# EAGLE board SensorNodeBoard_4_2_1AZ1b (EAGLE 7.6.0), part 1 of 2
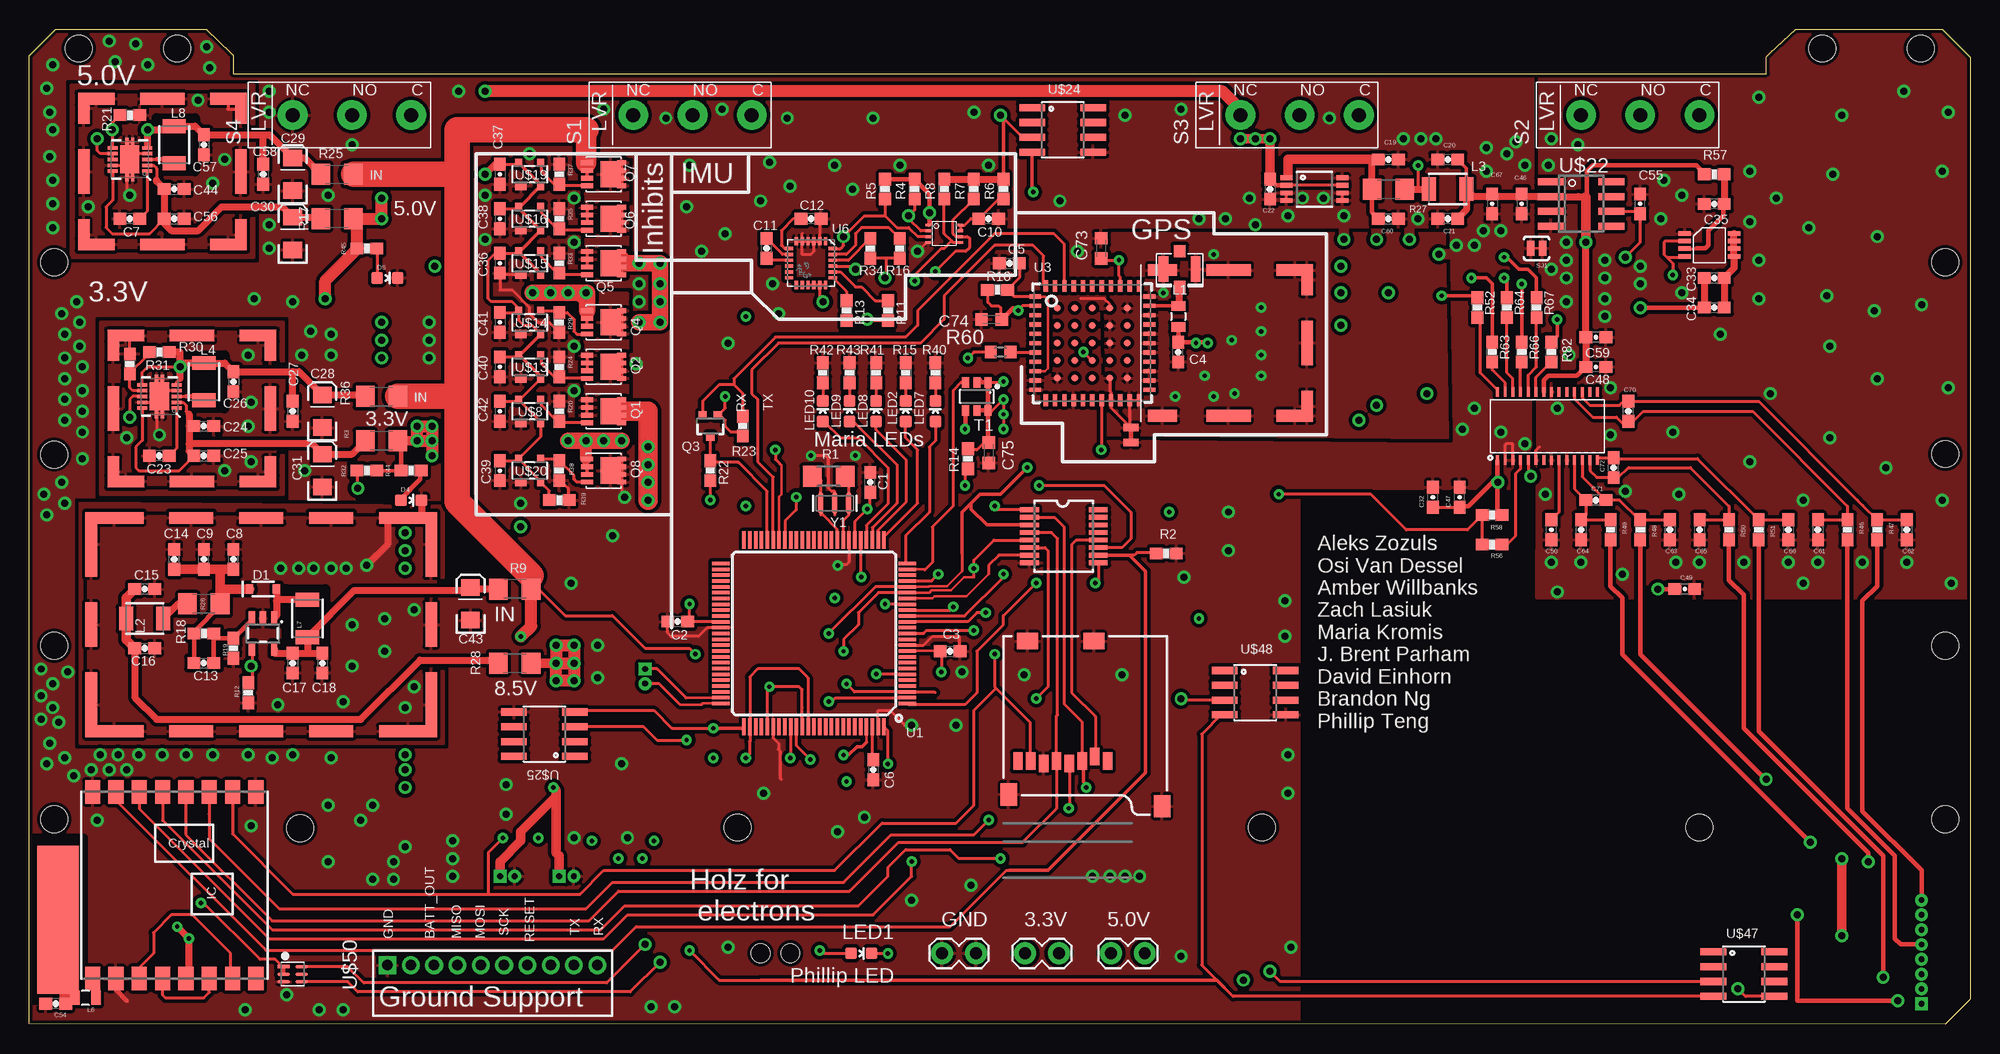
[diagram p7: board, top side]
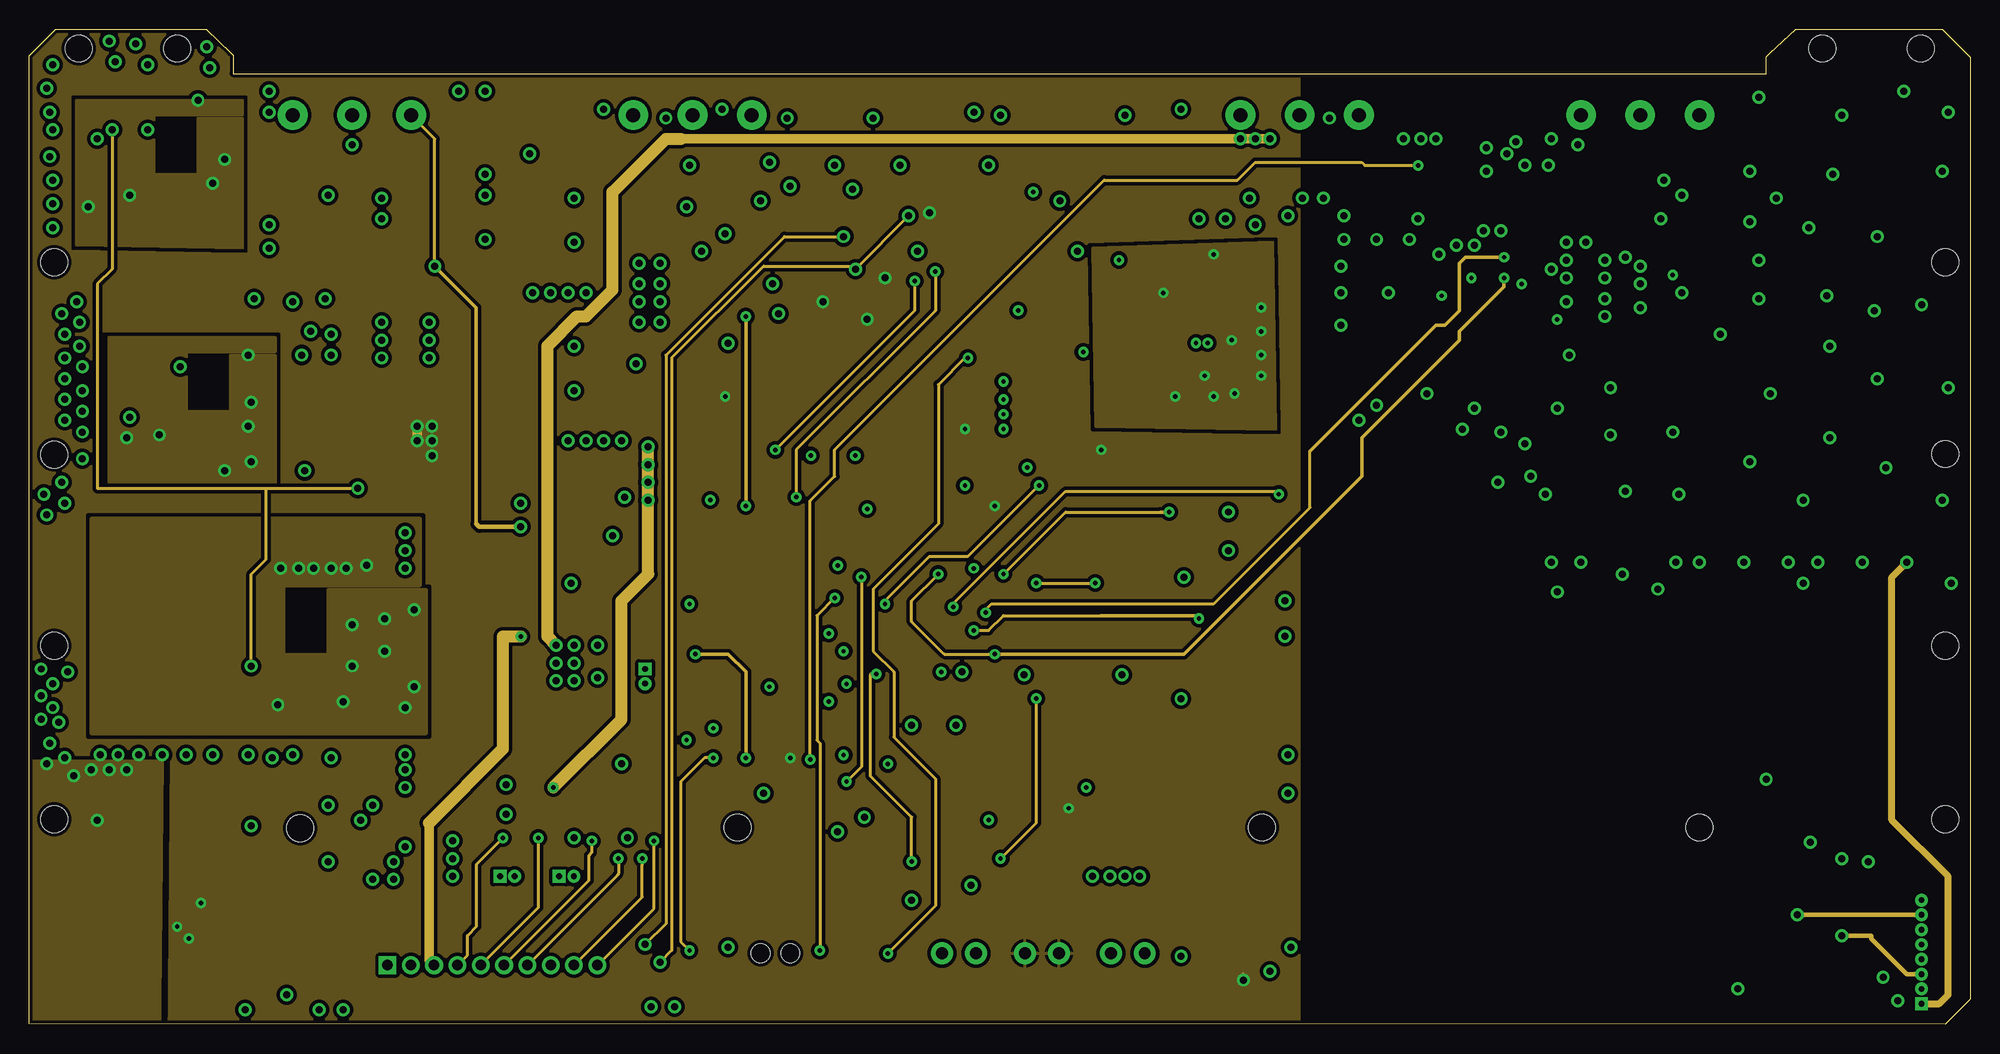
[diagram p8: board, inner layer Route2]
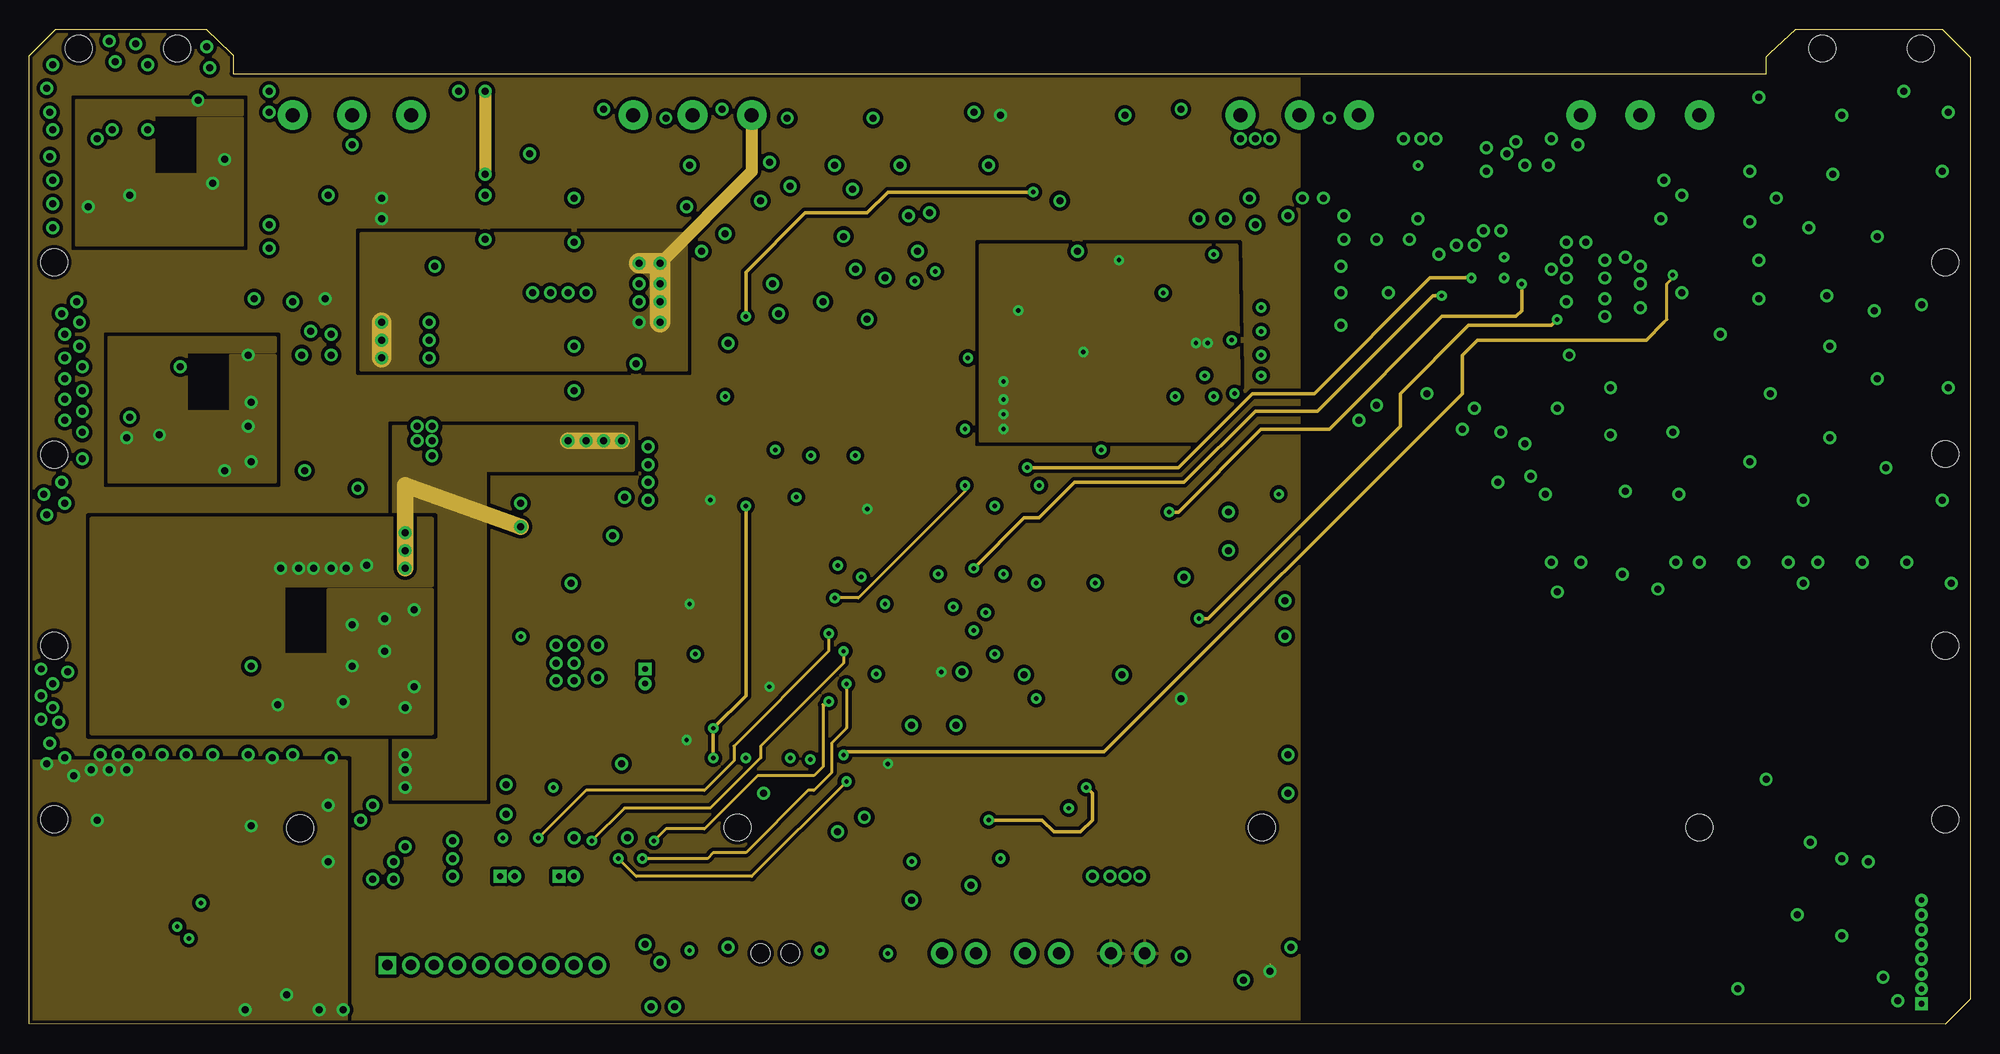
[diagram p9: board, inner layer Route15]
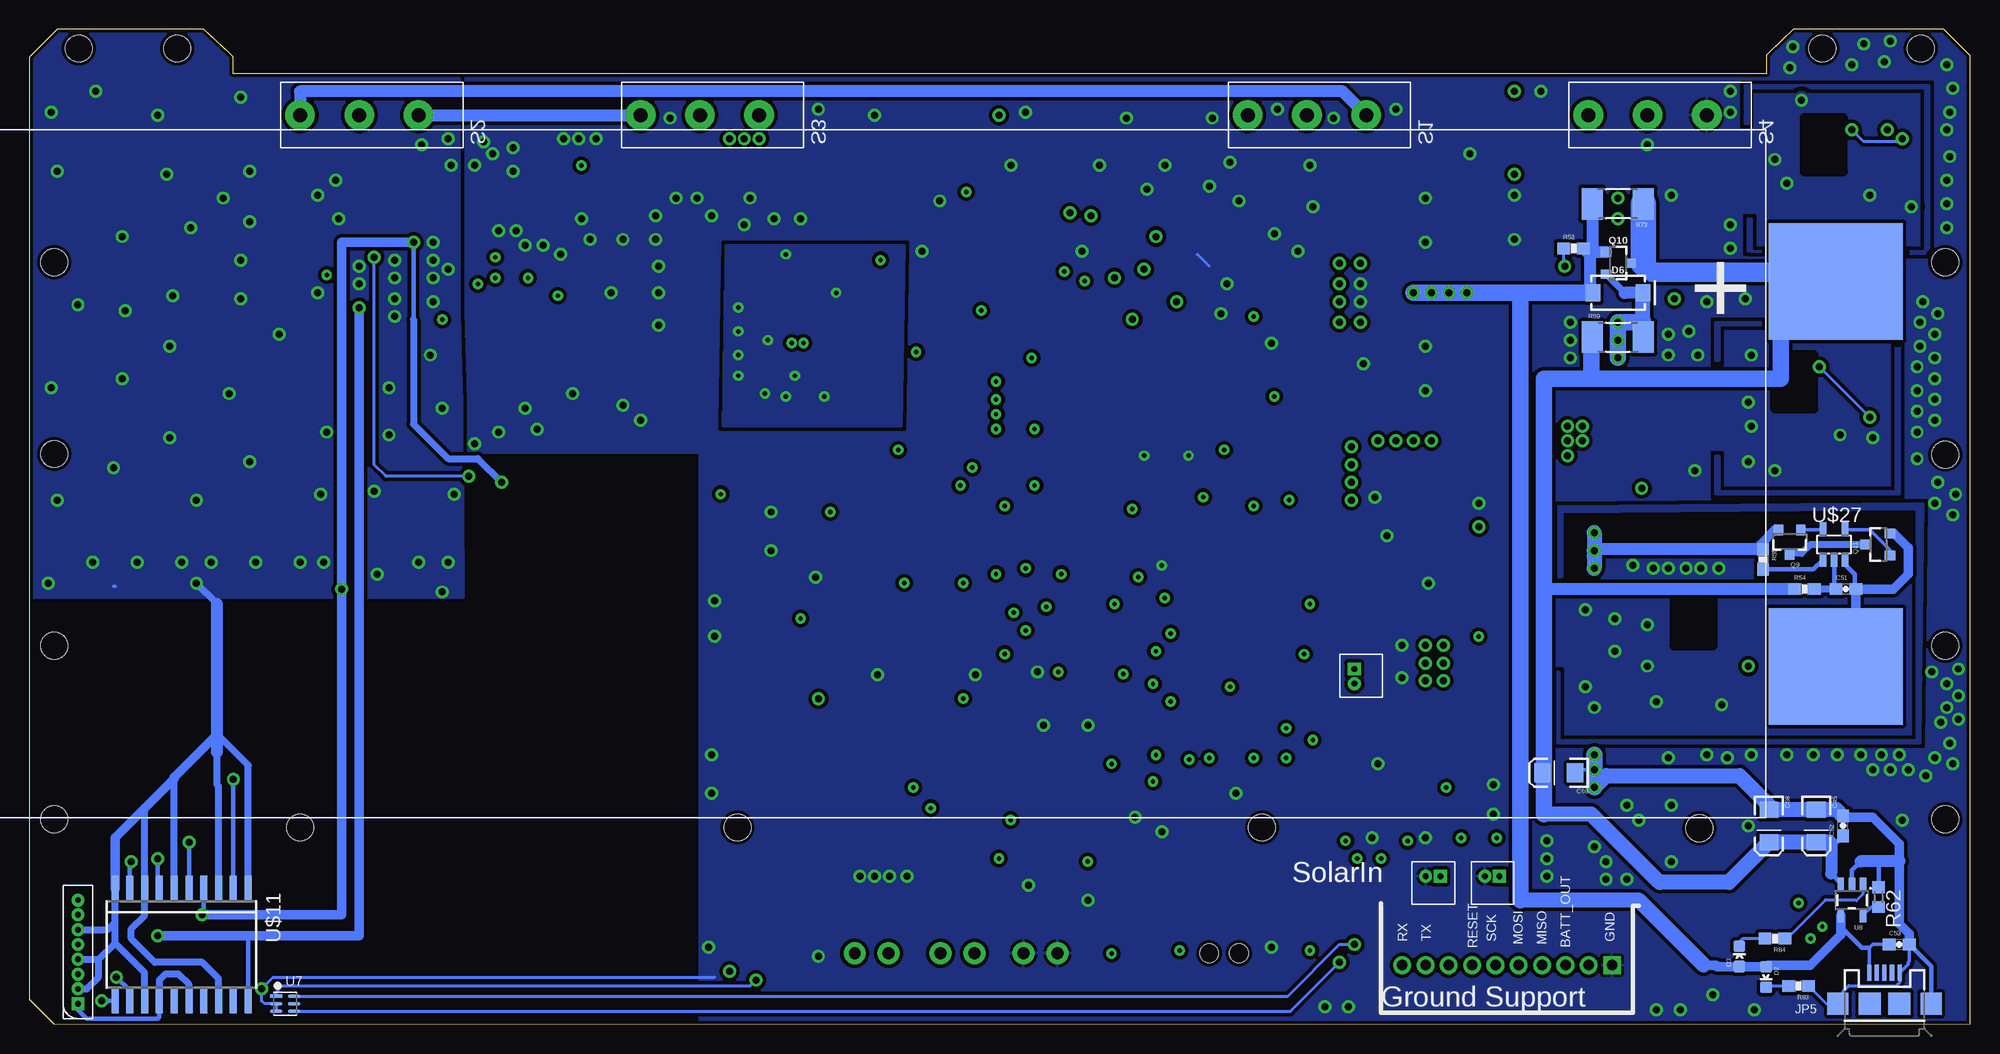
[diagram p10: board, bottom side, seen from below]

Size 166.49 x 85.34 mm. Coordinates in mm from the lower left corner, seen from the top.
Outline: 2.29,85.34 15.21,85.34 17.27,83.31 17.49,83.09 17.49,81.53 149,81.53 149,82.96 149.35,83.31 151.54,85.34 164.08,85.34 166.49,82.94 166.49,2.15 164.34,0 0,0.04 0,83.06 2.29,85.34
Copper layers (1*2*15*16): Top 0.035mm / dielectric 1.5mm / Route2 0.035mm / dielectric 0.15mm / Route15 0.035mm / dielectric 0.2mm / Bottom 0.035mm
Design rules "SparkFun *": minimum track width 8mil, minimum drill 20mil, track to track 7mil, track to pad 8mil, pad to pad 6mil, via to via 8mil, smd to smd 6mil, copper to edge 10mil, drill to drill 8mil, minimum pad ring 12mil, minimum via ring 10mil, stop-mask expansion 4mil, vias tented up to drill 25mil, thermal gap 10mil
Holes 2.29 mm at 2.15,65.36 2.15,48.86 2.15,17.6 2.15,32.48 164.35,65.35 164.35,48.92 164.35,32.48 164.35,17.6 162.25,83.69 153.79,83.69 12.7,83.69 4.25,83.69 60.75,16.89 23.25,16.83 143.25,16.89 105.75,16.89
Holes 1.6 mm at 62.74,6.1 65.28,6.1
tRestrict: area 22.1,32 to 25.4,37.3; area 10.9,73.2 to 14.2,77.7; area 13.5,52.8 to 16.8,57.4; area 1.8,1.8 to 5.3,2.8
bRestrict: area 22.1,32.5 to 25.4,37.3; area 10.9,73.2 to 14.2,77.7; area 13.5,52.8 to 16.8,57.4

## Footprints (pad centres in the part's own frame; a part is rotated, then mirrored left to right if it is on the bottom)
0603-CAP = smd 1.1 x 1: 1 -0.85,0; 2 0.85,0
EIA3216 = smd 1.4 x 1.6: A 1.4,0; C -1.4,0
C0603K = smd 1.05 x 1.08: 1 -0.875,0; 2 0.875,0
SOD-323 = smd 0.63 x 0.83: A 1.15,0; C -1.15,0
LED-0603 = smd 1 x 1: A 0,-0.877; C 0,0.877
SMA-DIODE = smd 1.27 x 1.47: A -2.15,0; C 2.15,0
1X02_1.25 = drill 0.5 square: P$1 0,0 | drill 0.5: P$2 1.25,0
U.FL = smd 2.2 x 0.85: P$1 0,1.375; P$2 0,-1.375 | smd 1.05 x 1: P$3 1.525,0; P$4 -1.525,0
USB-MICROB = smd 0.35 x 1.4: D+ 0,2.65; D- -0.65,2.65; GND 1.3,2.65; ID 0.65,2.65; VBUS -1.3,2.65 | smd 1.8 x 1.9: MT1 -4,0; MT2 4,0 | smd 1.9 x 1.9: P$1 -1.27,0; P$2 1.27,0
1X02_LOCK = drill 1.016 pad 1.88: 1 -0.178,0; 2 2.718,0
0805 = smd 0.8 x 1.2: 1 -0.9,0; 2 0.9,0
1210 = smd 1.2 x 2: 1 -1.6,0; 2 1.6,0
2PT_GND_TIE = smd 1.27 x 0.635: P$1 0,0.635; P$2 0,-0.635
POWERPAK1212-8 = smd 0.762 x 0.406: D1 1.549,0.991; D2 1.549,0.33; D3 1.549,-0.33; D4 1.549,-0.991 | smd 1.727 x 2.235: DPAD 0.584,0 | smd 0.991 x 0.406: G -1.422,-0.991; S1 -1.422,0.991; S2 -1.422,0.33; S3 -1.422,-0.33
SOT323 = smd 0.7 x 0.7: 1 -0.65,-0.925; 2 0.65,-0.925; 3 0,0.925
SOT23-3@1 = smd 0.8 x 0.9: 1 -0.95,-1; 2 0.95,-1; 3 0,1.1
SOT23-3 = smd 0.8 x 0.9: 1 -0.95,-1; 2 0.95,-1; 3 0,1.1
R1206 = smd 1.6 x 1.803: 1 -1.422,0; 2 1.422,0
0603-RES = smd 1.1 x 1: 1 -0.85,0; 2 0.85,0
1206 = smd 1.6 x 1.8: 1 -1.4,0; 2 1.4,0
R2010 = smd 1.8 x 2.7: 1 -2.2,0; 2 2.2,0
R0603 = smd 1 x 1.1: 1 -0.85,0; 2 0.85,0
CHERRY_SWITCH = drill 1.2 pad 2.54: COM 10.16,0; NC 0,0; NO 5.08,0
PAD-JUMPER-2-NC_BY_TRACE_YES_SILK = smd 0.635 x 1.27: 1 -0.508,0; 2 0.508,0
SOT23-6 = smd 0.6 x 0.9: 1 -0.95,-1.2; 2 0,-1.2; 3 0.95,-1.2; 4 0.95,1.2; 5 0,1.2; 6 -0.95,1.2
TQFP100 = smd 1.5 x 0.3: 1 -8,6; 2 -8,5.5; 3 -8,5; 4 -8,4.5; 5 -8,4; 6 -8,3.5; 7 -8,3; 8 -8,2.5; 9 -8,2; 10 -8,1.5; 11 -8,1; 12 -8,0.5; 13 -8,0; 14 -8,-0.5; 15 -8,-1; 16 -8,-1.5; 17 -8,-2; 18 -8,-2.5; 19 -8,-3; 20 -8,-3.5; 21 -8,-4; 22 -8,-4.5; 23 -8,-5; 24 -8,-5.5; 25 -8,-6; 51 8,-6; 52 8,-5.5; 53 8,-5; 54 8,-4.5; 55 8,-4; 56 8,-3.5; 57 8,-3; 58 8,-2.5; 59 8,-2; 60 8,-1.5; 61 8,-1; 62 8,-0.5; 63 8,0; 64 8,0.5; 65 8,1; 66 8,1.5; 67 8,2; 68 8,2.5; 69 8,3; 70 8,3.5; 71 8,4; 72 8,4.5; 73 8,5; 74 8,5.5; 75 8,6 | smd 0.3 x 1.5: 26 -6,-8; 27 -5.5,-8; 28 -5,-8; 29 -4.5,-8; 30 -4,-8; 31 -3.5,-8; 32 -3,-8; 33 -2.5,-8; 34 -2,-8; 35 -1.5,-8; 36 -1,-8; 37 -0.5,-8; 38 0,-8; 39 0.5,-8; 40 1,-8; 41 1.5,-8; 42 2,-8; 43 2.5,-8; 44 3,-8; 45 3.5,-8; 46 4,-8; 47 4.5,-8; 48 5,-8; 49 5.5,-8; 50 6,-8; 76 6,8; 77 5.5,8; 78 5,8; 79 4.5,8; 80 4,8; 81 3.5,8; 82 3,8; 83 2.5,8; 84 2,8; 85 1.5,8; 86 1,8; 87 0.5,8; 88 0,8; 89 -0.5,8; 90 -1,8; 91 -1.5,8; 92 -2,8; 93 -2.5,8; 94 -3,8; 95 -3.5,8; 96 -4,8; 97 -4.5,8; 98 -5,8; 99 -5.5,8; 100 -6,8
MICRO-SD-SOCKET-PP = smd 1.8 x 1.4: CD1 -2.05,0.4; CD2 -7.75,0.4 | smd 0.8 x 1.5: CS -7.84,10.3; DI -6.74,10.7; DO -2.34,10.7; GND -3.44,10.9; RSV1 -8.94,10.7; RSV2 -1.24,10.7; SCLK -4.54,10.7; VCC -5.64,10.9 | smd 1.4 x 1.9: GND1 -13.6,14.55; GND3 -0.45,13.55
VENUS638FLPX = smd 1 x 0.36: 1 -4.9,4; 2 -4.9,3.2; 3 -4.9,2.4; 4 -4.9,1.6; 5 -4.9,0.8; 6 -4.9,0; 7 -4.9,-0.8; 8 -4.9,-1.6; 9 -4.9,-2.4; 10 -4.9,-3.2; 11 -4.9,-4; 23 4.9,-4; 24 4.9,-3.2; 25 4.9,-2.4; 26 4.9,-1.6; 27 4.9,-0.8; 28 4.9,0; 29 4.9,0.8; 30 4.9,1.6; 31 4.9,2.4; 32 4.9,3.2; 33 4.9,4 | smd 0.36 x 1: 12 -4,-4.9; 13 -3.2,-4.9; 14 -2.4,-4.9; 15 -1.6,-4.9; 16 -0.8,-4.9; 17 0,-4.9; 18 0.8,-4.9; 19 1.6,-4.9; 20 2.4,-4.9; 21 3.2,-4.9; 22 4,-4.9; 34 4,4.9; 35 3.2,4.9; 36 2.4,4.9; 37 1.6,4.9; 38 0.8,4.9; 39 0,4.9; 40 -0.8,4.9; 41 -1.6,4.9; 42 -2.4,4.9; 43 -3.2,4.9; 44 -4,4.9 | smd 0.6 x 0.6: 45 -3,3; 46 -3,1.5; 47 -3,0; 48 -3,-1.5; 49 -3,-3; 50 -1.5,3; 51 -1.5,1.5; 52 -1.5,0; 53 -1.5,-1.5; 54 -1.5,-3; 55 0,3; 56 0,1.5; 57 0,0; 58 0,-1.5; 59 0,-3; 60 1.5,3; 61 1.5,1.5; 62 1.5,0; 63 1.5,-1.5; 64 1.5,-3; 65 3,3; 66 3,1.5; 67 3,0; 68 3,-1.5; 69 3,-3
PSOP-8 = smd 0.25 x 0.5: 1 -0.73,-1.37; 2 -0.23,-1.37; 3 0.27,-1.37; 4 0.77,-1.37; 5 0.77,1.38; 6 0.27,1.38; 7 -0.23,1.38; 8 -0.73,1.38
QFN-10_PAD = smd 0.297 x 0.85: 1 -1,-1.475; 2 -0.5,-1.475; 3 0,-1.475; 4 0.5,-1.475; 5 1,-1.475; 6 1,1.475; 7 0.5,1.475; 8 0,1.475; 9 -0.5,1.475; 10 -1,1.475 | smd 0.7 x 0.28: 11 -1.5,0.25; 12 -1.5,-0.25; 13 1.5,0.25; 14 1.5,-0.25 | smd 2.4 x 1.65: 15 0,0
LGA-24 = smd 0.7 x 0.29: 1 -1.875,1.25; 2 -1.875,0.75; 3 -1.875,0.25; 4 -1.875,-0.25; 5 -1.875,-0.75; 6 -1.875,-1.25; 13 1.875,-1.25; 14 1.875,-0.75; 15 1.875,-0.25; 16 1.875,0.25; 17 1.875,0.75; 18 1.875,1.25 | smd 0.29 x 0.7: 7 -1.25,-1.875; 8 -0.75,-1.875; 9 -0.25,-1.875; 10 0.25,-1.875; 11 0.75,-1.875; 12 1.25,-1.875; 19 1.25,1.875; 20 0.75,1.875; 21 0.25,1.875; 22 -0.25,1.875; 23 -0.75,1.875; 24 -1.25,1.875
FN-6 = smd 1.05 x 0.3: 1 -0.775,0.65; 2 -0.775,0; 3 -0.775,-0.65; 4 0.775,-0.65; 5 0.775,0; 6 0.775,0.65
SOT23-5 = smd 0.55 x 1.2: 1 -0.95,-1.3; 2 0,-1.3; 3 0.95,-1.3; 4 0.95,1.3; 5 -0.95,1.3
TSSOP16 = smd 0.4 x 1.6: 1 -2.225,-2.85; 2 -1.575,-2.85; 3 -0.925,-2.85; 4 -0.275,-2.85; 5 0.375,-2.85; 6 1.025,-2.85; 7 1.675,-2.85; 8 2.325,-2.85; 9 2.325,3.05; 10 1.675,3.05; 11 1.025,3.05; 12 0.375,3.05; 13 -0.275,3.05; 14 -0.925,3.05; 15 -1.575,3.05; 16 -2.225,3.05
RFM22-XXX-S2 = smd 2 x 1.3: 1 -8,7; 2 -8,5; 3 -8,3; 4 -8,1; 5 -8,-1; 6 -8,-3; 7 -8,-5; 8 -8,-7; 9 8,-7; 10 8,-5; 11 8,-3; 12 8,-1; 13 8,1; 14 8,3; 15 8,5; 16 8,7
MSOP-8 = smd 0.41 x 1.02: 1 -0.975,-2.4; 2 -0.325,-2.4; 3 0.325,-2.4; 4 0.975,-2.4; 5 0.975,2.4; 6 0.325,2.4; 7 -0.325,2.4; 8 -0.975,2.4
TSSOP28 = smd 0.8 x 0.25: 1 -2.921,4.623; 2 -2.921,3.962; 3 -2.921,3.302; 4 -2.921,2.642; 5 -2.921,1.981; 6 -2.921,1.321; 7 -2.921,0.66; 8 -2.927,0; 9 -2.921,-0.66; 10 -2.921,-1.321; 11 -2.921,-1.981; 12 -2.921,-2.642; 13 -2.921,-3.302; 14 -2.921,-3.962; 15 2.921,-3.962; 16 2.921,-3.302; 17 2.921,-2.642; 18 2.921,-1.981; 19 2.921,-1.321; 20 2.921,-0.66; 21 2.927,0; 22 2.921,0.66; 23 2.921,1.321; 24 2.921,1.981; 25 2.921,2.642; 26 2.921,3.302; 27 2.921,3.962; 28 2.921,4.623
SOT143 = smd 1 x 0.7: 1 -0.75,-1 | smd 0.6 x 0.7: 2 0.95,-1; 3 0.95,1; 4 -0.95,1
SOIC20R = smd 0.6 x 2.2: 1 -5.715,-4.775; 2 -4.445,-4.775; 3 -3.175,-4.775; 4 -1.905,-4.775; 5 -0.635,-4.775; 6 0.635,-4.775; 7 1.905,-4.775; 8 3.175,-4.775; 9 4.445,-4.8; 10 5.715,-4.8; 11 5.715,4.8; 12 4.445,4.8; 13 3.175,4.8; 14 1.905,4.8; 15 0.635,4.8; 16 -0.635,4.8; 17 -1.905,4.8; 18 -3.175,4.8; 19 -4.445,4.8; 20 -5.715,4.8
HMC1001 = drill 0.5 square: P$1 0,0 | drill 0.5: P$2 1.27,0; P$3 2.54,0; P$4 3.81,0; P$5 5.08,0; P$6 6.35,0; P$7 7.62,0; P$8 8.89,0
MICRO8 = smd 1.04 x 0.38: P$1 0,0; P$2 0,-0.65; P$3 0,-1.3; P$4 0,-1.95; P$5 4.24,0; P$6 4.24,-0.65; P$7 4.24,-1.3; P$8 4.24,-1.95
BATTERY = smd 11.492 x 10: + -6,13; - -6,46
SOIC8 = smd 0.6 x 2.2: 1 -1.905,-2.6; 2 -0.635,-2.6; 3 0.635,-2.6; 4 1.905,-2.6; 5 1.905,2.6; 6 0.635,2.6; 7 -0.635,2.6; 8 -1.905,2.6
SLOT = smd 12.7 x 3.556: P$1 6.5,2.746
SO08 = smd 0.61 x 2.21: 1 -1.905,-2.616; 2 -0.635,-2.616; 3 0.635,-2.616; 4 1.905,-2.616; 5 1.905,2.616; 6 0.635,2.616; 7 -0.635,2.616; 8 -1.905,2.616
SOT25 = smd 0.55 x 1.2: 1 -0.95,-1.3; 2 0,-1.3; 3 0.95,-1.3; 4 0.95,1.3; 5 -0.95,1.3
SHIELD_BMI-S-209-C = smd 4.98 x 1: P$1 2.49,0.5; P$5 27.67,0.5; P$9 2.49,18.8; P$13 27.67,18.8 | smd 3.8 x 1: P$2 9.08,0.5; P$3 15.08,0.5; P$4 21.08,0.5; P$10 9.08,18.8; P$11 15.08,18.8; P$12 21.08,18.8 | smd 1 x 5.55: P$6 0.5,2.775; P$8 0.5,16.525; P$14 29.66,16.525; P$16 29.66,2.775 | smd 1 x 3.8: P$7 0.5,9.65; P$15 29.66,9.65
SHIELD_BMI-S-201-C = smd 2.65 x 1: P$1 1.325,0.5; P$3 12.175,0.5; P$10 1.325,13.96; P$12 12.175,13.96 | smd 3.8 x 1: P$2 6.75,0.5; P$11 6.75,13.96 | smd 1 x 3.13: P$4 0.5,1.565; P$5 13,1.565; P$8 0.5,12.895; P$9 13,12.895 | smd 1 x 3.8: P$6 0.5,7.23; P$7 13,7.23
SULLRT1X10-2MM = drill 0.9 square: 1 0,0 | drill 0.9: 2 2,0; 3 4,0; 4 6,0; 5 8,0; 6 10,0; 7 12,0; 8 14,0; 9 16,0; 10 18,0
SHIELD_BMI-201-C-REV = smd 2.65 x 1: P$1 1.325,0.5; P$3 12.175,0.5 | smd 3.8 x 1: P$2 6.75,0.5 | smd 1 x 3.13: P$4 0.5,1.565; P$5 13,1.565 | smd 1 x 3.8: P$6 0.5,7.23; P$7 13,7.23 | smd 1 x 2.5: P$8 0.5,12.895; P$9 13,12.895
RESONATOR-SMD = smd 0.45 x 1.905: 1 -1.2,0; 2 0,0; 3 1.2,0

## Placement (x,y rotation side)
C1  .1uf  [0603-CAP]  72.14,46.48 90 top
C2  .1uf  [0603-CAP]  55.63,34.54 180 top
C3  10uf  [0603-CAP]  78.99,32 0 top
C4  22pF  [0603-CAP]  98.55,57.66 90 top
C5  1uF  [0603-CAP]  84.07,65.28 0 top
C6  .1uf  [0603-CAP]  72.39,21.84 270 top
C7  0.1uF  [0603-CAP]  8.64,69.09 180 top
C8  10uF  [0603-CAP]  17.53,39.88 90 top
C9  1uF  [0603-CAP]  14.99,39.88 90 top
C10  0.1uF  [0603-CAP]  82.3,69.09 180 top
C11  0.22uF  [0603-CAP]  63.25,66.55 90 top
C12  4.7uF  [0603-CAP]  67.06,69.09 180 top
C13  330pF  [0603-CAP]  14.99,30.99 0 top
C14  0.1uF  [0603-CAP]  12.45,39.88 90 top
C15  10uF  [0603-CAP]  9.91,37.34 0 top
C16  10uF  [0603-CAP]  9.91,32.26 0 top
C17  0.1uF  [0603-CAP]  22.61,30.99 270 top
C18  10uF  [0603-CAP]  25.15,30.99 270 top
C19  0.1uF  [0603-CAP]  116.59,74.17 0 top
C20  10uF  [0603-CAP]  121.67,74.17 180 top
C21  10uF  [0603-CAP]  121.67,69.09 180 top
C22  1uF  [0603-CAP]  106.43,71.63 270 top
C23  0.1uF  [0603-CAP]  11.18,48.77 180 top
C24  0.1uF  [0603-CAP]  14.99,51.31 0 top
C25  10uF  [0603-CAP]  14.99,48.77 0 top
C26  10uF  [0603-CAP]  17.53,55.12 270 top
C27  0.1uF  [0603-CAP]  22.61,52.58 270 top
C28  [EIA3216]  25.15,52.58 90 top
C29  [EIA3216]  22.61,72.9 90 top
C30  [EIA3216]  22.61,67.82 90 top
C31  [EIA3216]  25.15,47.5 90 top
C32  10uF  [0603-CAP]  120.4,45.21 90 top
C33  0.1uF  [0603-CAP]  144.53,64.01 0 top
C34  0.1uF  [0603-CAP]  144.53,61.47 0 top
C35  1uF  [0603-CAP]  144.53,70.36 180 top
C36  4.7u  [0603-CAP]  40.39,65.28 270 top
C37  4.7u  [0603-CAP]  40.39,72.9 270 top
C38  4.7u  [0603-CAP]  40.39,69.09 270 top
C39  4.7u  [0603-CAP]  40.39,47.5 270 top
C40  4.7u  [0603-CAP]  40.39,56.39 270 top
C41  4.7u  [0603-CAP]  40.39,60.2 270 top
C42  [0603-CAP]  40.39,52.58 270 top
C43  47uF  [EIA3216]  37.85,36.07 90 top
C44  0.1uF  [0603-CAP]  12.45,71.63 0 top
C45  47uF  [EIA3216]  13.21,17.02 270 bottom
C46  0.1uF  [0603-CAP]  128.02,70.36 270 top
C47  0.1uF  [0603-CAP]  122.68,45.21 90 top
C48  0.1uF  [0603-CAP]  134.37,56.39 180 top
C49  0.1u  [0603-CAP]  141.99,37.34 0 top
C50  10uF  [0603-CAP]  130.56,42.42 90 top
C51  100nF  [0603-CAP]  10.67,37.34 0 bottom
C52  4.7uF  [0603-CAP]  10.92,17.02 90 bottom
C53  4.7uF  [0603-CAP]  6.1,6.86 0 bottom
C54  [0603-CAP]  2.29,1.78 180 top
C55  0.1uF  [0603-CAP]  138.18,70.36 90 top
C56  10uF  [0603-CAP]  12.45,69.09 0 top
C57  10uF  [0603-CAP]  14.99,75.44 270 top
C58  0.1uF  [0603-CAP]  20.07,72.9 270 top
C59  10uF  [0603-CAP]  134.37,58.93 180 top
C60  10uF  [0603-CAP]  116.59,69.09 0 top
C61  1uF  [0603-CAP]  153.42,42.42 270 top
C62  1uF  [0603-CAP]  161.04,42.42 270 top
C63  1uF  [0603-CAP]  140.72,42.42 270 top
C64  1uF  [0603-CAP]  133.1,42.42 270 top
C65  1uF  [0603-CAP]  143.26,42.42 270 top
C66  1uF  [0603-CAP]  150.88,42.42 270 top
C67  10uF  [0603-CAP]  125.48,70.36 270 top
C68  47uF  [EIA3216]  17.27,17.02 270 bottom
C69  47uF  [EIA3216]  35.31,21.59 180 bottom
C70  1uF  [0603-CAP]  137.16,52.58 90 top
C71  1uF  [0603-CAP]  134.37,44.96 180 top
C72  1uF  [0603-CAP]  135.89,47.75 90 top
C73  [C0603K]  91.95,66.55 90 top
C74  [C0603K]  82.55,60.45 180 top
C75  [C0603K]  82.3,49.02 270 top
D1  DIODE-BAS16J  [SOD-323]  20.07,37.34 0 top
D2  [LED-0603]  17.53,4.06 180 bottom
D3  [LED-0603]  19.81,5.84 0 bottom
D4  [LED-0603]  32.77,44.96 270 top
D5  [LED-0603]  30.73,64.01 270 top
D6  3A/40V/500mV  [SMA-DIODE]  30.23,62.74 0 bottom
J1  [1X02_1.25]  45.47,12.7 180 bottom
J2  U.FL  [U.FL]  98.68,64.77 270 top
J3  [1X02_1.25]  40.39,12.7 180 bottom
J4  [1X02_1.25]  52.83,30.48 270 bottom
JP5  USB-MICROB  [USB-MICROB]  7.37,1.78 0 bottom
JP12  [1X02_LOCK]  92.96,6.1 0 top
JP13  [1X02_LOCK]  85.6,6.1 0 top
JP14  [1X02_LOCK]  78.49,6.1 0 top
L1  33nH  [0805]  98.55,60.71 270 top
L2  10uH  [1210]  9.91,34.8 180 top
L3  10uH  [1210]  121.67,71.63 0 top
L4  2.2uH  [1210]  14.99,55.12 270 top
L6  [0805]  4.83,2.29 180 top
L7  10uH  [1210]  23.88,34.8 90 top
L8  2.2uH  [1210]  12.45,75.44 270 top
LED1  [LED-0603]  71.37,6.1 270 top
LED2  [LED-0603]  75.18,52.58 0 top
LED7  [LED-0603]  77.72,52.58 0 top
LED8  [LED-0603]  72.64,52.58 0 top
LED9  [LED-0603]  70.36,52.58 0 top
LED10  [LED-0603]  68.07,52.58 0 top
PT1  2PT_GND_TIE  [2PT_GND_TIE]  94.49,50.55 180 top
Q1  MOSFET-NCHANNELSI7820DN  [POWERPAK1212-8]  49.28,52.58 0 top
Q2  MOSFET-NCHANNELSI7820DN  [POWERPAK1212-8]  49.28,56.39 0 top
Q3  MOSFET-NCHANNEL2N7002PW  [SOT323]  58.42,51.31 180 top
Q4  MOSFET-NCHANNELSI7820DN  [POWERPAK1212-8]  49.28,60.2 0 top
Q5  MOSFET-NCHANNELSI7820DN  [POWERPAK1212-8]  49.28,65.28 0 top
Q6  MOSFET-NCHANNELSI7820DN  [POWERPAK1212-8]  49.28,69.09 0 top
Q7  MOSFET-NCHANNELSI7820DN  [POWERPAK1212-8]  49.28,72.9 0 top
Q8  MOSFET-NCHANNELSI7820DN  [POWERPAK1212-8]  49.28,47.5 0 top
Q9  MOSFET-NCHANNELSSM3K324R  [SOT23-3@1]  15.49,41.4 180 bottom
Q10  4.3A/20V/54mΩ  [SOT23-3]  30.23,65.28 270 bottom
Q11  MOSFET-NCHANNELSSM3K324R  [SOT23-3@1]  7.87,41.15 90 bottom
R1  1M  [R1206]  68.58,46.99 0 top
R2  10k  [0603-RES]  97.54,40.39 180 top
R3  0  [1206]  30.23,50.04 180 top
R4  1k  [0603-RES]  75.95,71.63 90 top
R5  1k  [0603-RES]  73.41,71.63 90 top
R6  200k  [0603-RES]  83.57,71.63 90 top
R7  1k  [0603-RES]  81.03,71.63 90 top
R8  1k  [0603-RES]  78.49,71.63 90 top
R9  [1206]  41.66,37.34 180 top
R10  33k  [0603-RES]  83.06,62.99 180 top
R11  10k  [0603-RES]  73.66,61.21 270 top
R12  10k  [0603-RES]  18.8,28.45 90 top
R13  10k  [0603-RES]  70.1,61.21 270 top
R14  750  [0603-RES]  80.52,48.51 90 top
R15  [0603-RES]  75.18,55.88 270 top
R16  10k  [0603-RES]  74.68,66.55 270 top
R17  0  [1206]  26.42,69.09 180 top
R18  75k  [0603-RES]  14.99,33.53 180 top
R19  13.3K  [0603-RES]  17.53,32.26 90 top
R20  5.1M  [0603-RES]  45.47,52.58 270 top
R21  10k  [0603-RES]  8.64,77.98 180 top
R22  10k  [0603-RES]  58.42,47.5 270 top
R23  10k  [0603-RES]  61.21,51.31 270 top
R24  5.1M  [0603-RES]  45.47,56.39 270 top
R25  0  [1206]  26.42,72.9 0 top
R26  [1206]  14.99,36.07 180 top
R27  [1206]  116.59,71.63 0 top
R28  [1206]  41.66,30.99 0 top
R29  5.1M  [0603-RES]  45.47,60.2 90 top
R30  1M  [0603-RES]  11.18,57.66 0 top
R31  100K  [0603-RES]  8.64,56.64 270 top
R32  0  [0603-RES]  28.96,47.5 0 top
R33  5.1M  [0603-RES]  45.47,65.28 270 top
R34  10k  [0603-RES]  72.14,66.55 270 top
R35  5.1M  [0603-RES]  45.47,69.09 270 top
R36  0  [1206]  30.23,53.85 0 top
R37  5.1M  [0603-RES]  45.47,72.9 270 top
R38  5.1M  [0603-RES]  45.47,47.5 90 top
R39  5.1M  [0603-RES]  45.47,44.96 180 top
R40  [0603-RES]  77.72,55.88 270 top
R41  750  [0603-RES]  72.64,55.88 90 top
R42  750  [0603-RES]  68.07,55.88 270 top
R43  750  [0603-RES]  70.36,55.88 270 top
R44  0  [0603-RES]  32.77,47.5 0 top
R45  0  [0603-RES]  28.96,66.55 0 top
R46  510  [0603-RES]  155.96,42.42 270 top
R47  510  [0603-RES]  158.5,42.42 270 top
R48  510  [0603-RES]  138.18,42.42 270 top
R49  510  [0603-RES]  135.64,42.42 270 top
R50  510  [0603-RES]  145.8,42.42 270 top
R51  510  [0603-RES]  148.34,42.42 270 top
R52  47  [0603-RES]  124.21,61.47 90 top
R53  100k  [0603-RES]  34.04,66.55 0 bottom
R54  470  [0603-RES]  14.22,37.34 0 bottom
R55  2.7k  [0603-RES]  17.78,39.88 270 bottom
R56  47  [0603-RES]  125.48,41.15 180 top
R57  220  [0603-RES]  144.53,72.9 0 top
R58  10k  [0603-RES]  125.48,43.69 180 top
R59  0  [R2010]  30.23,58.93 0 bottom
R60  [R0603]  83.31,57.66 0 top
R62  2k  [R0603]  7.87,10.92 270 bottom
R63  47  [0603-RES]  125.48,57.66 90 top
R64  47  [0603-RES]  126.75,61.47 90 top
R66  47  [0603-RES]  128.02,57.66 90 top
R67  47  [0603-RES]  129.29,61.47 90 top
R73  0  [R2010]  30.23,70.36 180 bottom
R82  47  [0603-RES]  130.56,57.66 90 top
R83  470  [0603-RES]  14.73,3.3 180 bottom
R84  470  [0603-RES]  16.76,7.37 180 bottom
S1  [CHERRY_SWITCH]  51.82,77.98 0 top
S2  [CHERRY_SWITCH]  133.1,77.98 0 top
S3  [CHERRY_SWITCH]  103.89,77.98 0 top
S4  [CHERRY_SWITCH]  22.61,77.98 0 top
SJ1  JUMPER-PAD-2-NC_BY_TRACE  [PAD-JUMPER-2-NC_BY_TRACE_YES_SILK]  129.29,66.55 180 top
T1  [SOT23-6]  81.28,53.85 180 top
U1  ATMEGA2560AU  [TQFP100]  67.31,33.53 180 top
U2  USD-SOCKETNEW  [MICRO-SD-SOCKET-PP]  83.57,33.27 180 top
U3  VENUS638FLPX-L  [VENUS638FLPX]  91.19,58.42 0 top
U4  [PSOP-8]  78.49,67.82 270 top
U5  TPS61200  [QFN-10_PAD]  11.18,53.85 90 top
U6  LSM9DS0  [LGA-24]  67.06,65.28 270 top
U7  TSL2561FN  [FN-6]  144.53,1.78 0 bottom
U8  MCP73831  [SOT23-5]  10.16,10.67 180 bottom
U9  TSL2561FN  [FN-6]  22.61,4.32 0 top
U11  TPS61200  [QFN-10_PAD]  8.64,74.17 90 top
U$1  74HC4050  [TSSOP16]  88.65,41.91 270 top
U$3  RFM22SMD  [RFM22-XXX-S2]  12.45,11.94 90 top
U$4  LM2731  [SOT23-5]  20.07,33.53 180 top
U$6  ADP3333  [MSOP-8]  110.24,71.63 270 top
U$7  ADS1248  [TSSOP28]  130.56,51.31 90 top
U$8  MIC5018  [SOT143]  42.93,52.58 0 top
U$11  HMC1002  [SOIC20R]  153.42,6.86 180 bottom
U$12  HMC1001  [HMC1001]  162.31,1.78 90 bottom
U$13  MIC5018  [SOT143]  42.93,56.39 0 top
U$14  MIC5018  [SOT143]  42.93,60.2 0 top
U$15  MIC5018  [SOT143]  42.93,65.28 0 top
U$16  MIC5018  [SOT143]  42.93,69.09 0 top
U$17  IRF7509  [MICRO8]  141.99,67.82 0 top
U$18  BATTERY  [BATTERY]  17.53,76.71 180 bottom
U$19  MIC5018  [SOT143]  42.93,72.9 0 top
U$20  MIC5018  [SOT143]  42.93,47.5 0 top
U$22  ADR441  [SOIC8]  133.1,70.36 270 top
U$23  SNB_ANT  [SLOT]  -0.25,15.49 270 top
U$24  DS18B202  [SO08]  88.65,76.71 270 top
U$25  DS18B202  [SO08]  44.2,24.89 90 top
U$27  AP9101C  [SOT25]  11.68,41.15 0 bottom
U$37  SHEILD2  [SHIELD_BMI-S-209-C]  4.83,24.64 0 top
U$39  SHEILD  [SHIELD_BMI-S-201-C]  4.19,79.88 270 top
U$41  SHEILD  [SHIELD_BMI-S-201-C]  6.73,59.56 270 top
U$47  DS18B202  [SO08]  147.07,4.32 270 top
U$48  DS18B202  [SO08]  105.16,28.45 270 top
U$50  SULLIN1X10RT  [SULLRT1X10-2MM]  30.73,5.08 0 top
U$52  SHEILD3  [SHIELD_BMI-201-C-REV]  110.11,51.69 90 top
Y1  16MHZ  [RESONATOR-SMD]  69.09,44.7 180 top